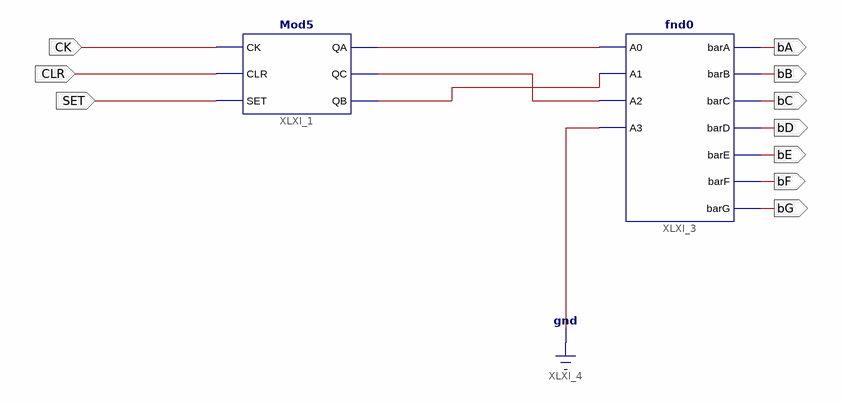
[diagram p0: schematic sheet 1]
// Xilinx ISE schematic Mod5_D.sch (spartan6) as structural Verilog: 2 symbols, 10 ports
module Mod5_D (
  input  CK,
  input  CLR,
  input  SET,
  output bA,
  output bB,
  output bC,
  output bD,
  output bE,
  output bF,
  output bG
);

  wire XLXN_4, XLXN_5, XLXN_6;

  Mod5 XLXI_1 (.CK(CK), .CLR(CLR), .SET(SET), .QA(XLXN_6), .QC(XLXN_4), .QB(XLXN_5));
  fnd0 XLXI_3 (
    .A3(1'b0), .A2(XLXN_4), .A1(XLXN_5), .A0(XLXN_6), .barA(bA), .barB(bB), .barC(bC), .barD(bD), .barE(bE),
    .barF(bF), .barG(bG));
endmodule
